# Altium schematic sheet DDR.SchDoc
size A3; SheetNumber: 3; SheetTotal: 9
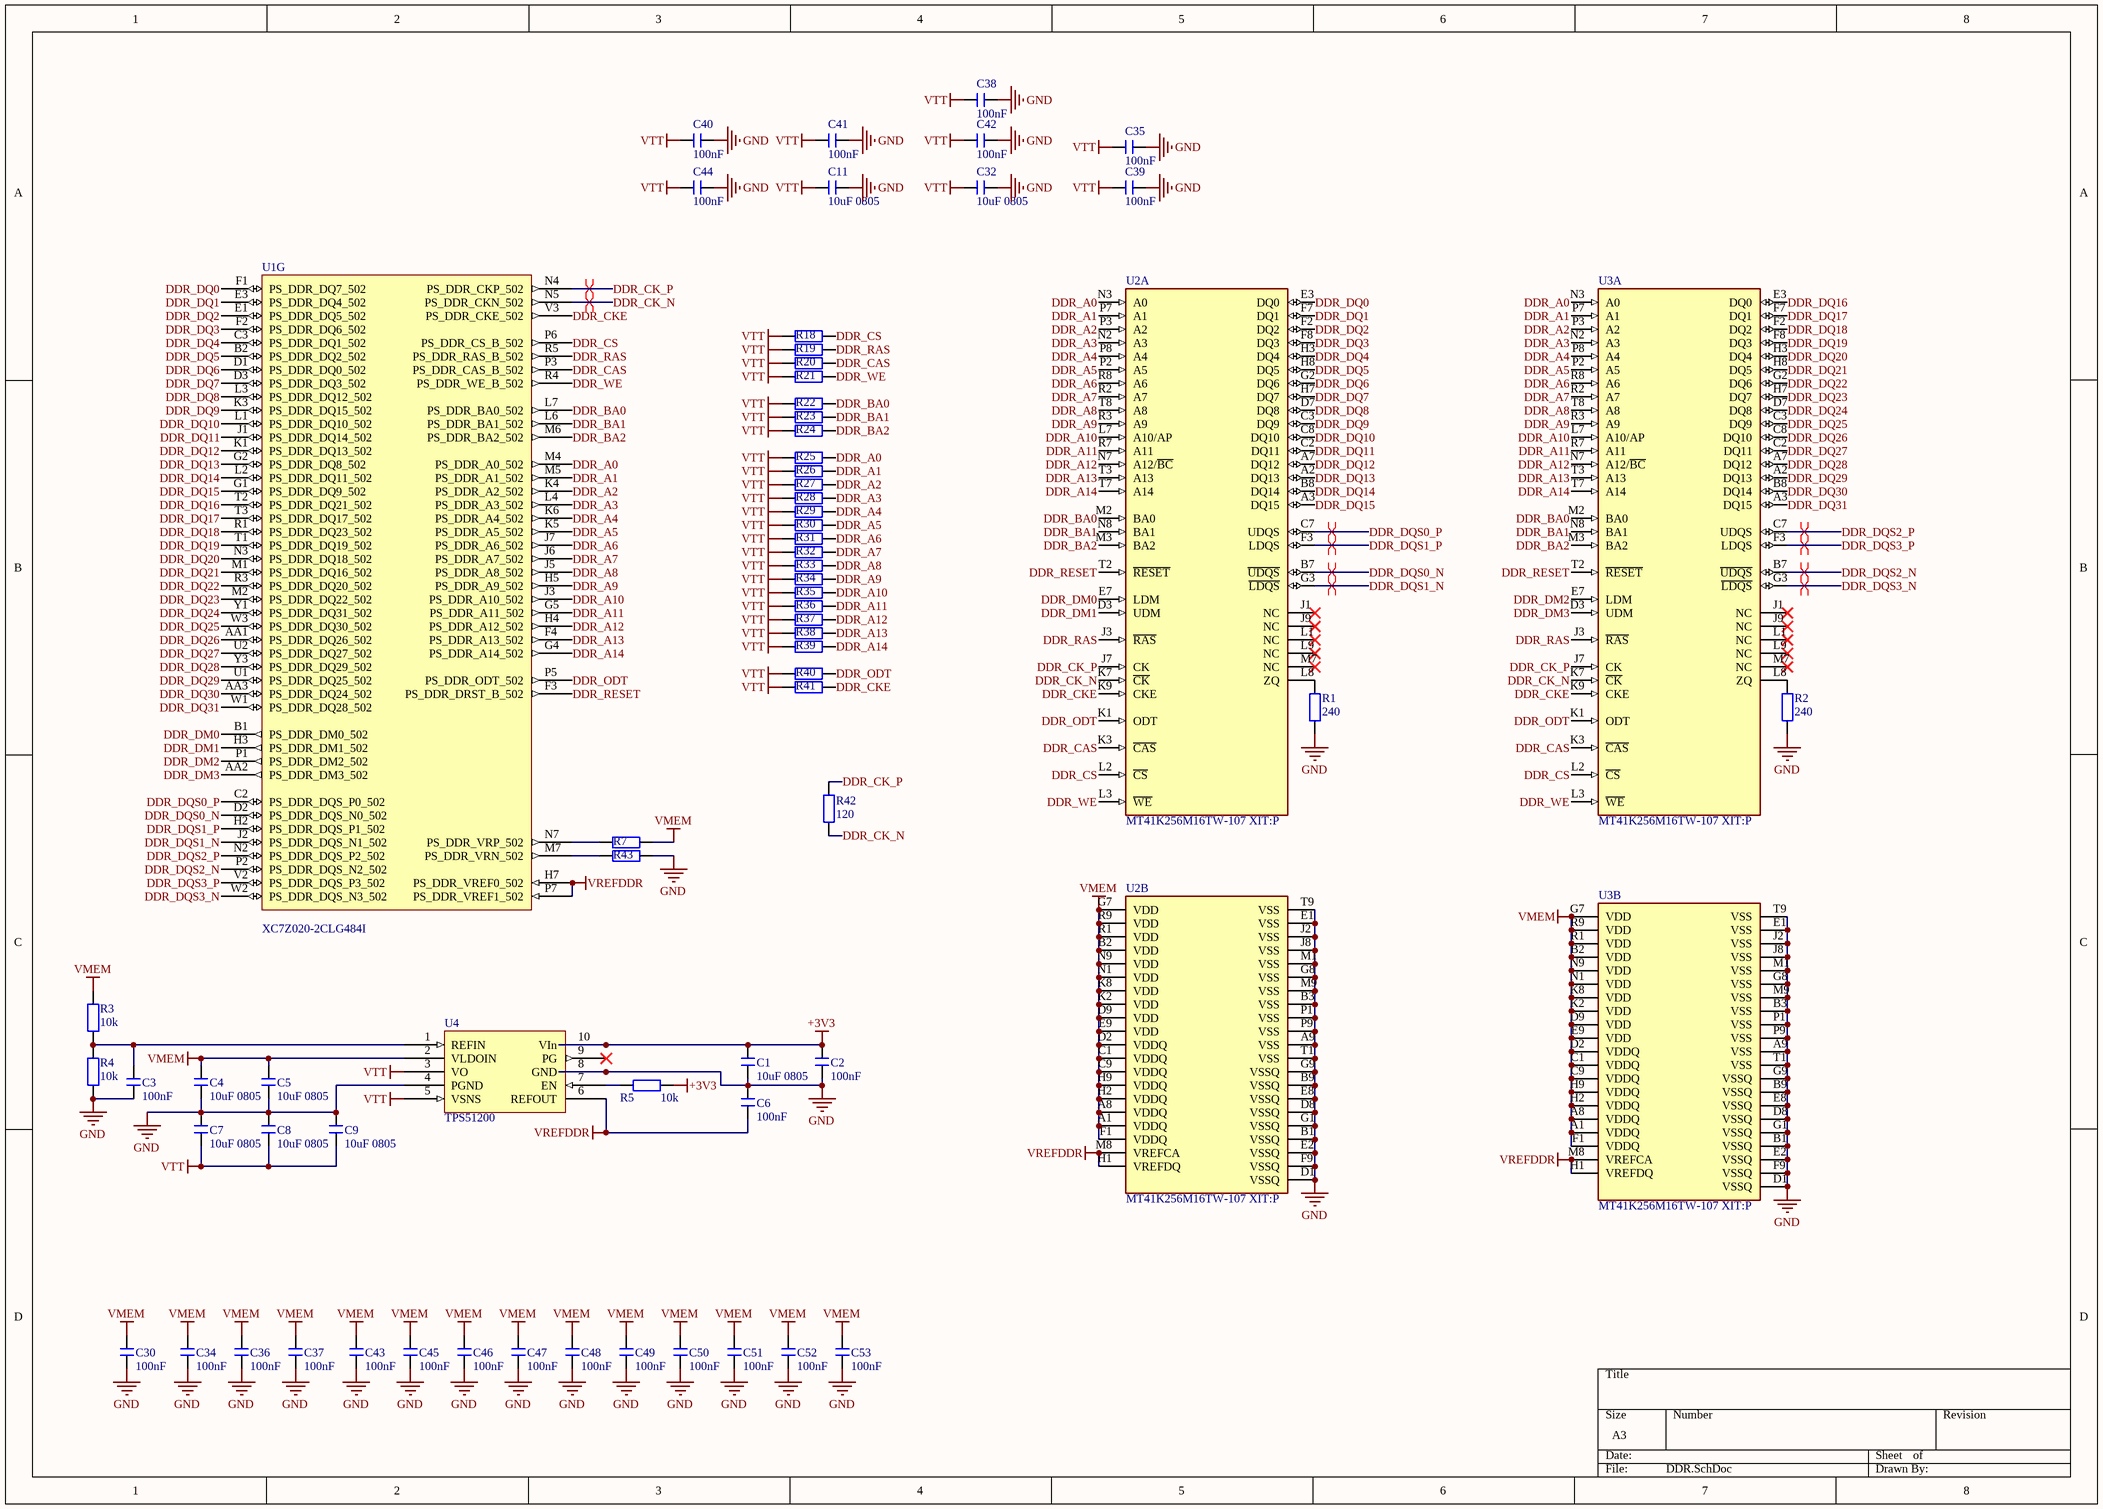
[diagram p0: DDR.SchDoc]

## Parts
C1  10uF 0805  [C0603]
C2  100nF  [C0402]
C3  100nF  [C0402]
C4  10uF 0805  [C0603]
C5  10uF 0805  [C0603]
C6  100nF  [C0402]
C7  10uF 0805  [C0603]
C8  10uF 0805  [C0603]
C9  10uF 0805  [C0603]
C11  10uF 0805  [C0603]
C30  100nF  [C0402]
C32  10uF 0805  [C0603]
C34  100nF  [C0402]
C35  100nF  [C0402]
C36  100nF  [C0402]
C37  100nF  [C0402]
C38  100nF  [C0402]
C39  100nF  [C0402]
C40  100nF  [C0402]
C41  100nF  [C0402]
C42  100nF  [C0402]
C43  100nF  [C0402]
C44  100nF  [C0402]
C45  100nF  [C0402]
C46  100nF  [C0402]
C47  100nF  [C0402]
C48  100nF  [C0402]
C49  100nF  [C0402]
C50  100nF  [C0402]
C51  100nF  [C0402]
C52  100nF  [C0402]
C53  100nF  [C0402]
R1  240  [R0402]
R2  240  [R0402]
R3  10k  [R0402]
R4  10k  [R0402]
R5  10k  [R0402]
R7  49.9  [R0402]  (value not drawn)
R18  49.9  [R0402]  (value not drawn)
R19  49.9  [R0402]  (value not drawn)
R20  49.9  [R0402]  (value not drawn)
R21  49.9  [R0402]  (value not drawn)
R22  49.9  [R0402]  (value not drawn)
R23  49.9  [R0402]  (value not drawn)
R24  49.9  [R0402]  (value not drawn)
R25  49.9  [R0402]  (value not drawn)
R26  49.9  [R0402]  (value not drawn)
R27  49.9  [R0402]  (value not drawn)
R28  49.9  [R0402]  (value not drawn)
R29  49.9  [R0402]  (value not drawn)
R30  49.9  [R0402]  (value not drawn)
R31  49.9  [R0402]  (value not drawn)
R32  49.9  [R0402]  (value not drawn)
R33  49.9  [R0402]  (value not drawn)
R34  49.9  [R0402]  (value not drawn)
R35  49.9  [R0402]  (value not drawn)
R36  49.9  [R0402]  (value not drawn)
R37  49.9  [R0402]  (value not drawn)
R38  49.9  [R0402]  (value not drawn)
R39  49.9  [R0402]  (value not drawn)
R40  49.9  [R0402]  (value not drawn)
R41  49.9  [R0402]  (value not drawn)
R42  120  [R0402]
R43  49.9  [R0402]  (value not drawn)
U1  XC7Z020-2CLG484I  [CLG484]  (part G of 10)
U2  MT41K256M16TW-107 XIT:P  [FP-TW-MFG]  (parts A,B of 2)
U3  MT41K256M16TW-107 XIT:P  [FP-TW-MFG]  (parts A,B of 2)
U4  TPS51200  [SON50P300X100_HS-11N]

## Nets
+3V3: C1.2 C2.2 R5.2 U4.10(VIn)
GND: C1.1 C2.1 C3.1 C4.1 C5.1 C6.2 C7.2 C8.2 C9.2 C11.1 C30.1 C32.1 C34.1 C35.1 C36.1 C37.1 C38.1 C39.1 C40.1 C41.1 C42.1 C43.1 C44.1 C45.1 C46.1 C47.1 C48.1 C49.1 C50.1 C51.1 C52.1 C53.1 R1.2 R2.2 R4.2 R43.2 U2.A9(VSS) U2.B1(VSSQ) U2.B3(VSS) U2.B9(VSSQ) U2.D1(VSSQ) U2.D8(VSSQ) U2.E1(VSS) U2.E2(VSSQ) U2.E8(VSSQ) U2.F9(VSSQ) U2.G1(VSSQ) U2.G8(VSS) U2.G9(VSSQ) U2.J2(VSS) U2.J8(VSS) U2.M1(VSS) U2.M9(VSS) U2.P1(VSS) U2.P9(VSS) U2.T1(VSS) U2.T9(VSS) U3.A9(VSS) U3.B1(VSSQ) U3.B3(VSS) U3.B9(VSSQ) U3.D1(VSSQ) U3.D8(VSSQ) U3.E1(VSS) U3.E2(VSSQ) U3.E8(VSSQ) U3.F9(VSSQ) U3.G1(VSSQ) U3.G8(VSS) U3.G9(VSSQ) U3.J2(VSS) U3.J8(VSS) U3.M1(VSS) U3.M9(VSS) U3.P1(VSS) U3.P9(VSS) U3.T1(VSS) U3.T9(VSS) U4.4(PGND) U4.8(GND)
VMEM: C4.2 C5.2 C30.2 C34.2 C36.2 C37.2 C43.2 C45.2 C46.2 C47.2 C48.2 C49.2 C50.2 C51.2 C52.2 C53.2 R3.1 R7.2 U2.A1(VDDQ) U2.A8(VDDQ) U2.B2(VDD) U2.C1(VDDQ) U2.C9(VDDQ) U2.D2(VDDQ) U2.D9(VDD) U2.E9(VDD) U2.F1(VDDQ) U2.G7(VDD) U2.H2(VDDQ) U2.H9(VDDQ) U2.K2(VDD) U2.K8(VDD) U2.N1(VDD) U2.N9(VDD) U2.R1(VDD) U2.R9(VDD) U3.A1(VDDQ) U3.A8(VDDQ) U3.B2(VDD) U3.C1(VDDQ) U3.C9(VDDQ) U3.D2(VDDQ) U3.D9(VDD) U3.E9(VDD) U3.F1(VDDQ) U3.G7(VDD) U3.H2(VDDQ) U3.H9(VDDQ) U3.K2(VDD) U3.K8(VDD) U3.N1(VDD) U3.N9(VDD) U3.R1(VDD) U3.R9(VDD) U4.2(VLDOIN)
VREFDDR: C6.1 U1.H7(PS_DDR_VREF0_502) U1.P7(PS_DDR_VREF1_502) U2.H1(VREFDQ) U2.M8(VREFCA) U3.H1(VREFDQ) U3.M8(VREFCA) U4.6(REFOUT)
VTT: C7.1 C8.1 C9.1 C11.2 C32.2 C35.2 C38.2 C39.2 C40.2 C41.2 C42.2 C44.2 R18.1 R19.1 R20.1 R21.1 R22.1 R23.1 R24.1 R25.1 R26.1 R27.1 R28.1 R29.1 R30.1 R31.1 R32.1 R33.1 R34.1 R35.1 R36.1 R37.1 R38.1 R39.1 R40.1 R41.1 U4.3(VO) U4.5(VSNS)
DDR_A0: R25.2 U1.M4(PS_DDR_A0_502) U2.N3(A0) U3.N3(A0)
DDR_A1: R26.2 U1.M5(PS_DDR_A1_502) U2.P7(A1) U3.P7(A1)
DDR_A2: R27.2 U1.K4(PS_DDR_A2_502) U2.P3(A2) U3.P3(A2)
DDR_A3: R28.2 U1.L4(PS_DDR_A3_502) U2.N2(A3) U3.N2(A3)
DDR_A4: R29.2 U1.K6(PS_DDR_A4_502) U2.P8(A4) U3.P8(A4)
DDR_A5: R30.2 U1.K5(PS_DDR_A5_502) U2.P2(A5) U3.P2(A5)
DDR_A6: R31.2 U1.J7(PS_DDR_A6_502) U2.R8(A6) U3.R8(A6)
DDR_A7: R32.2 U1.J6(PS_DDR_A7_502) U2.R2(A7) U3.R2(A7)
DDR_A8: R33.2 U1.J5(PS_DDR_A8_502) U2.T8(A8) U3.T8(A8)
DDR_A9: R34.2 U1.H5(PS_DDR_A9_502) U2.R3(A9) U3.R3(A9)
DDR_A10: R35.2 U1.J3(PS_DDR_A10_502) U2.L7(A10/AP) U3.L7(A10/AP)
DDR_A11: R36.2 U1.G5(PS_DDR_A11_502) U2.R7(A11) U3.R7(A11)
DDR_A12: R37.2 U1.H4(PS_DDR_A12_502) U2.N7(A12/~{BC}) U3.N7(A12/~{BC})
DDR_A13: R38.2 U1.F4(PS_DDR_A13_502) U2.T3(A13) U3.T3(A13)
DDR_A14: R39.2 U1.G4(PS_DDR_A14_502) U2.T7(A14) U3.T7(A14)
DDR_BA0: R22.2 U1.L7(PS_DDR_BA0_502) U2.M2(BA0) U3.M2(BA0)
DDR_BA1: R23.2 U1.L6(PS_DDR_BA1_502) U2.N8(BA1) U3.N8(BA1)
DDR_BA2: R24.2 U1.M6(PS_DDR_BA2_502) U2.M3(BA2) U3.M3(BA2)
DDR_CAS: R20.2 U1.P3(PS_DDR_CAS_B_502) U2.K3(~{CAS}) U3.K3(~{CAS})
DDR_CK_N: R42.1 U1.N5(PS_DDR_CKN_502) U2.K7(~{CK}) U3.K7(~{CK})
DDR_CK_P: R42.2 U1.N4(PS_DDR_CKP_502) U2.J7(CK) U3.J7(CK)
DDR_CKE: R41.2 U1.V3(PS_DDR_CKE_502) U2.K9(CKE) U3.K9(CKE)
DDR_CS: R18.2 U1.P6(PS_DDR_CS_B_502) U2.L2(~{CS}) U3.L2(~{CS})
DDR_DM0: U1.B1(PS_DDR_DM0_502) U2.E7(LDM)
DDR_DM1: U1.H3(PS_DDR_DM1_502) U2.D3(UDM)
DDR_DM2: U1.P1(PS_DDR_DM2_502) U3.E7(LDM)
DDR_DM3: U1.AA2(PS_DDR_DM3_502) U3.D3(UDM)
DDR_DQ0: U1.F1(PS_DDR_DQ7_502) U2.E3(DQ0)
DDR_DQ1: U1.E3(PS_DDR_DQ4_502) U2.F7(DQ1)
DDR_DQ2: U1.E1(PS_DDR_DQ5_502) U2.F2(DQ2)
DDR_DQ3: U1.F2(PS_DDR_DQ6_502) U2.F8(DQ3)
DDR_DQ4: U1.C3(PS_DDR_DQ1_502) U2.H3(DQ4)
DDR_DQ5: U1.B2(PS_DDR_DQ2_502) U2.H8(DQ5)
DDR_DQ6: U1.D1(PS_DDR_DQ0_502) U2.G2(DQ6)
DDR_DQ7: U1.D3(PS_DDR_DQ3_502) U2.H7(DQ7)
DDR_DQ8: U1.L3(PS_DDR_DQ12_502) U2.D7(DQ8)
DDR_DQ9: U1.K3(PS_DDR_DQ15_502) U2.C3(DQ9)
DDR_DQ10: U1.L1(PS_DDR_DQ10_502) U2.C8(DQ10)
DDR_DQ11: U1.J1(PS_DDR_DQ14_502) U2.C2(DQ11)
DDR_DQ12: U1.K1(PS_DDR_DQ13_502) U2.A7(DQ12)
DDR_DQ13: U1.G2(PS_DDR_DQ8_502) U2.A2(DQ13)
DDR_DQ14: U1.L2(PS_DDR_DQ11_502) U2.B8(DQ14)
DDR_DQ15: U1.G1(PS_DDR_DQ9_502) U2.A3(DQ15)
DDR_DQ16: U1.T2(PS_DDR_DQ21_502) U3.E3(DQ0)
DDR_DQ17: U1.T3(PS_DDR_DQ17_502) U3.F7(DQ1)
DDR_DQ18: U1.R1(PS_DDR_DQ23_502) U3.F2(DQ2)
DDR_DQ19: U1.T1(PS_DDR_DQ19_502) U3.F8(DQ3)
DDR_DQ20: U1.N3(PS_DDR_DQ18_502) U3.H3(DQ4)
DDR_DQ21: U1.M1(PS_DDR_DQ16_502) U3.H8(DQ5)
DDR_DQ22: U1.R3(PS_DDR_DQ20_502) U3.G2(DQ6)
DDR_DQ23: U1.M2(PS_DDR_DQ22_502) U3.H7(DQ7)
DDR_DQ24: U1.Y1(PS_DDR_DQ31_502) U3.D7(DQ8)
DDR_DQ25: U1.W3(PS_DDR_DQ30_502) U3.C3(DQ9)
DDR_DQ26: U1.AA1(PS_DDR_DQ26_502) U3.C8(DQ10)
DDR_DQ27: U1.U2(PS_DDR_DQ27_502) U3.C2(DQ11)
DDR_DQ28: U1.Y3(PS_DDR_DQ29_502) U3.A7(DQ12)
DDR_DQ29: U1.U1(PS_DDR_DQ25_502) U3.A2(DQ13)
DDR_DQ30: U1.AA3(PS_DDR_DQ24_502) U3.B8(DQ14)
DDR_DQ31: U1.W1(PS_DDR_DQ28_502) U3.A3(DQ15)
DDR_DQS0_N: U1.D2(PS_DDR_DQS_N0_502) U2.B7(~{UDQS})
DDR_DQS0_P: U1.C2(PS_DDR_DQS_P0_502) U2.C7(UDQS)
DDR_DQS1_N: U1.J2(PS_DDR_DQS_N1_502) U2.G3(~{LDQS})
DDR_DQS1_P: U1.H2(PS_DDR_DQS_P1_502) U2.F3(LDQS)
DDR_DQS2_N: U1.P2(PS_DDR_DQS_N2_502) U3.B7(~{UDQS})
DDR_DQS2_P: U1.N2(PS_DDR_DQS_P2_502) U3.C7(UDQS)
DDR_DQS3_N: U1.W2(PS_DDR_DQS_N3_502) U3.G3(~{LDQS})
DDR_DQS3_P: U1.V2(PS_DDR_DQS_P3_502) U3.F3(LDQS)
DDR_ODT: R40.2 U1.P5(PS_DDR_ODT_502) U2.K1(ODT) U3.K1(ODT)
DDR_RAS: R19.2 U1.R5(PS_DDR_RAS_B_502) U2.J3(~{RAS}) U3.J3(~{RAS})
DDR_RESET: U1.F3(PS_DDR_DRST_B_502) U2.T2(~{RESET}) U3.T2(~{RESET})
DDR_WE: R21.2 U1.R4(PS_DDR_WE_B_502) U2.L3(~{WE}) U3.L3(~{WE})
NetC3_2: C3.2 R3.2 R4.1 U4.1(REFIN)
NetR1_1: R1.1 U2.L8(ZQ)
NetR2_1: R2.1 U3.L8(ZQ)
NetR5_1: R5.1 U4.7(EN)
NetR7_1: R7.1 U1.N7(PS_DDR_VRP_502)
NetR43_1: R43.1 U1.M7(PS_DDR_VRN_502)

Not connected (* = marked no-connect by the designer): U2 J1(NC)* J9(NC)* L1(NC)* L9(NC)* M7(NC)*; U3 J1(NC)* J9(NC)* L1(NC)* L9(NC)* M7(NC)*; U4 9(PG)*

## Layout directives
differential pair: DDR_CK_N, DDR_CK_P, DDR_DQS0_N, DDR_DQS0_P, DDR_DQS1_N, DDR_DQS1_P, DDR_DQS2_N, DDR_DQS2_P, DDR_DQS3_N, DDR_DQS3_P

## Library data of the parts
C1-C9 C11 C30 C32 C34-C53 = C
R1-R5 R7 R18-R43 = R
U1 = CMP-0363-00013-3: 733 MHz Zynq™-7000 AP SoC, 130 PS I/O, 200 FPGA I/O, 484-Ball BGA, Speed Grade 2, Industrial Grade, Pb-Free; Speed Grade: -2; Flip Flops: 106400; LUTs: 53200; Extensible Block RAM (# 36Kb Blocks): 560 KB (140); Rule: UNIONINDEX=0|RULEKIND=SignalStimulus|NETSCOPE=AnyNet|LAYERKIND=SameLayer|NAME=Schematic Signal Stimulus|KIND=2|LEVEL=0|STARTTIME=1.000m|STOPTIME=9.000m|PERIODTIME=10.00m|UNIT=Imperial; Rule: UNIONINDEX=0|RULEKIND=SupplyNets|NETSCOPE=AnyNet|LAYERKIND=SameLayer|NAME=Schematic Supply Nets|VOLTAGE=1.500|UNIT=Imperial; ComponentLink3URL: http://www.xilinx.com/support/documentation/data_sheets/ds187-XC7Z010-XC7Z020-Data-Sheet.pdf; PackageReference: CLG484; Code_JEDEC: MO-275-PPAA-2; ComponentLink2URL: http://www.xilinx.com/support/documentation/user_guides/ug865-Zynq-7000-Pkg-Pinout.pdf; ComponentLink2Description: Package Specification; ComponentLink6URL: http://www.xilinx.com/support/documentation/user_guides/ug483_7Series_PCB.pdf; PackageVersion: Rev 1.1, 09/2012; DatasheetVersion: v1.2; PartNumber: XC7Z020-2CLG484I; ComponentLink3Description: DC and AC Switching Characteristics; PackageDescription: Wire-Bond Chip-Scale BGA, Body 19 x 19 mm, 0.8 mm Pitch; RoHS: Pb-Free; ComponentLink5URL: http://www.xilinx.com/support/documentation/user_guides/ug865-Zynq-7000-Pkg-Pinout.pdf; ComponentLink1URL: http://www.xilinx.com/support/documentation/data_sheets/ds190-Zynq-7000-Overview.pdf; ComponentLink4Description: Package File; Generic Part Number: XC7Z020; Mounting Technology: Surface Mount; ComponentLink1Description: Datasheet; ComponentLink4URL: http://www.xilinx.com/support/packagefiles/z7packages/xc7z020clg484pkg.txt; ComponentLink6Description: PCB and Layout Guide; ComponentLink5Description: Packaging and Pinout
U2 U3 = CMP-2000-07474-2: IC DRAM 4GBIT PARALLEL 96FBGA
U4 = TPS51200: Sink and Source DDR Termination Regulator